# Altium schematic sheet FC_BlockDiagram.SchDoc
size A3; Date: 01.12.2023; DrawnBy: Oğuz Kaan ATAY; Engineer: Oğuzhan EŞEN; SheetNumber: 2; SheetTotal: 2
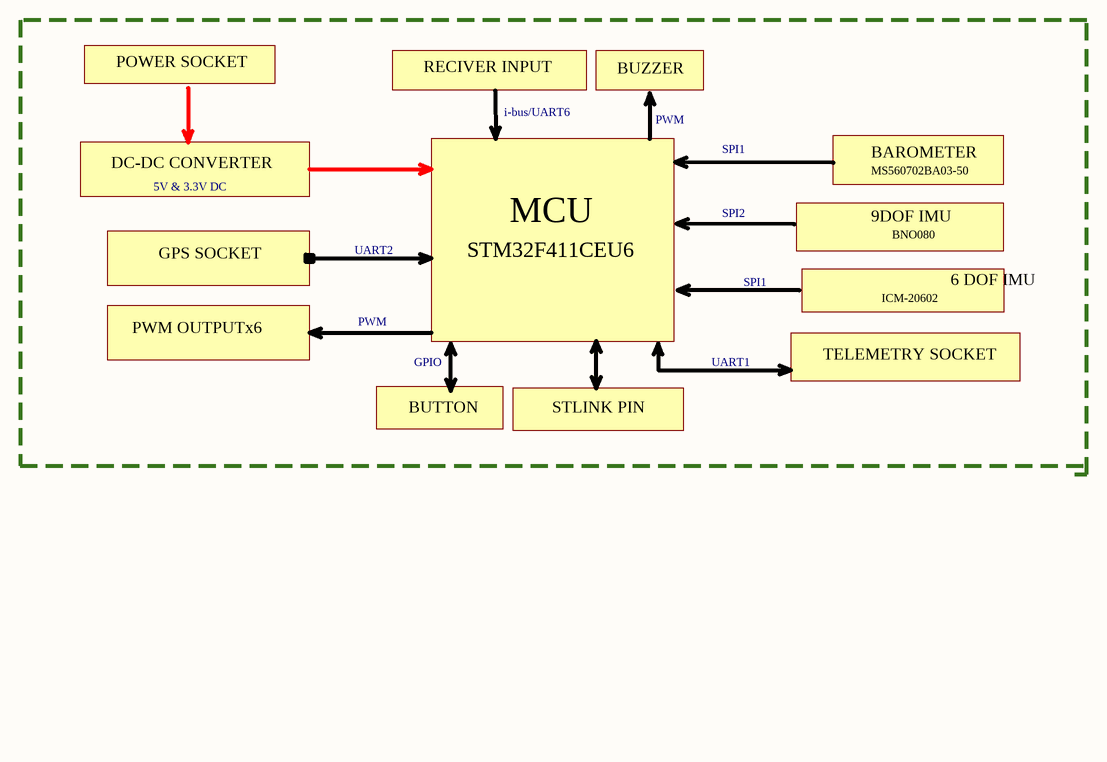
[diagram p0: FC_BlockDiagram.SchDoc]

## Notes on the sheet
- POWER SOCKET
- RECIVER INPUT
- i-bus/UART6
- BUZZER
- PWM
- DC-DC CONVERTER
- 5V & 3.3V DC
- SPI1
- BAROMETER
- MS560702BA03-50
- GPS SOCKET
- UART2
- STM32F411CEU6
- MCU
- SPI2
- 9DOF IMU
- BNO080
- ICM-20602
- 6 DOF IMU
- PWM OUTPUTx6
- GPIO
- UART1
- TELEMETRY SOCKET
- BUTTON
- STLINK PIN
- -KOMPANENTLER-
  MCU:TFPT1206L1002FM
  BAROMETRE:M41T00
  9DOF IMU:ESP32-WROOM-32E(4MB)
  6 DOF IMU:LHI 876/3902
  GPS:MAX6662MSA+
  TELEMETRY:STM32F103C6T6A
  RELAY:ALQ112
  BUZZER:CMI-9605IC-0580T
  SENSOR ON/OFF:EG1215AA
  3.3V DC: AP7361-33E-13
- Drawn By
- Company
- Date
- Size
- Sheet